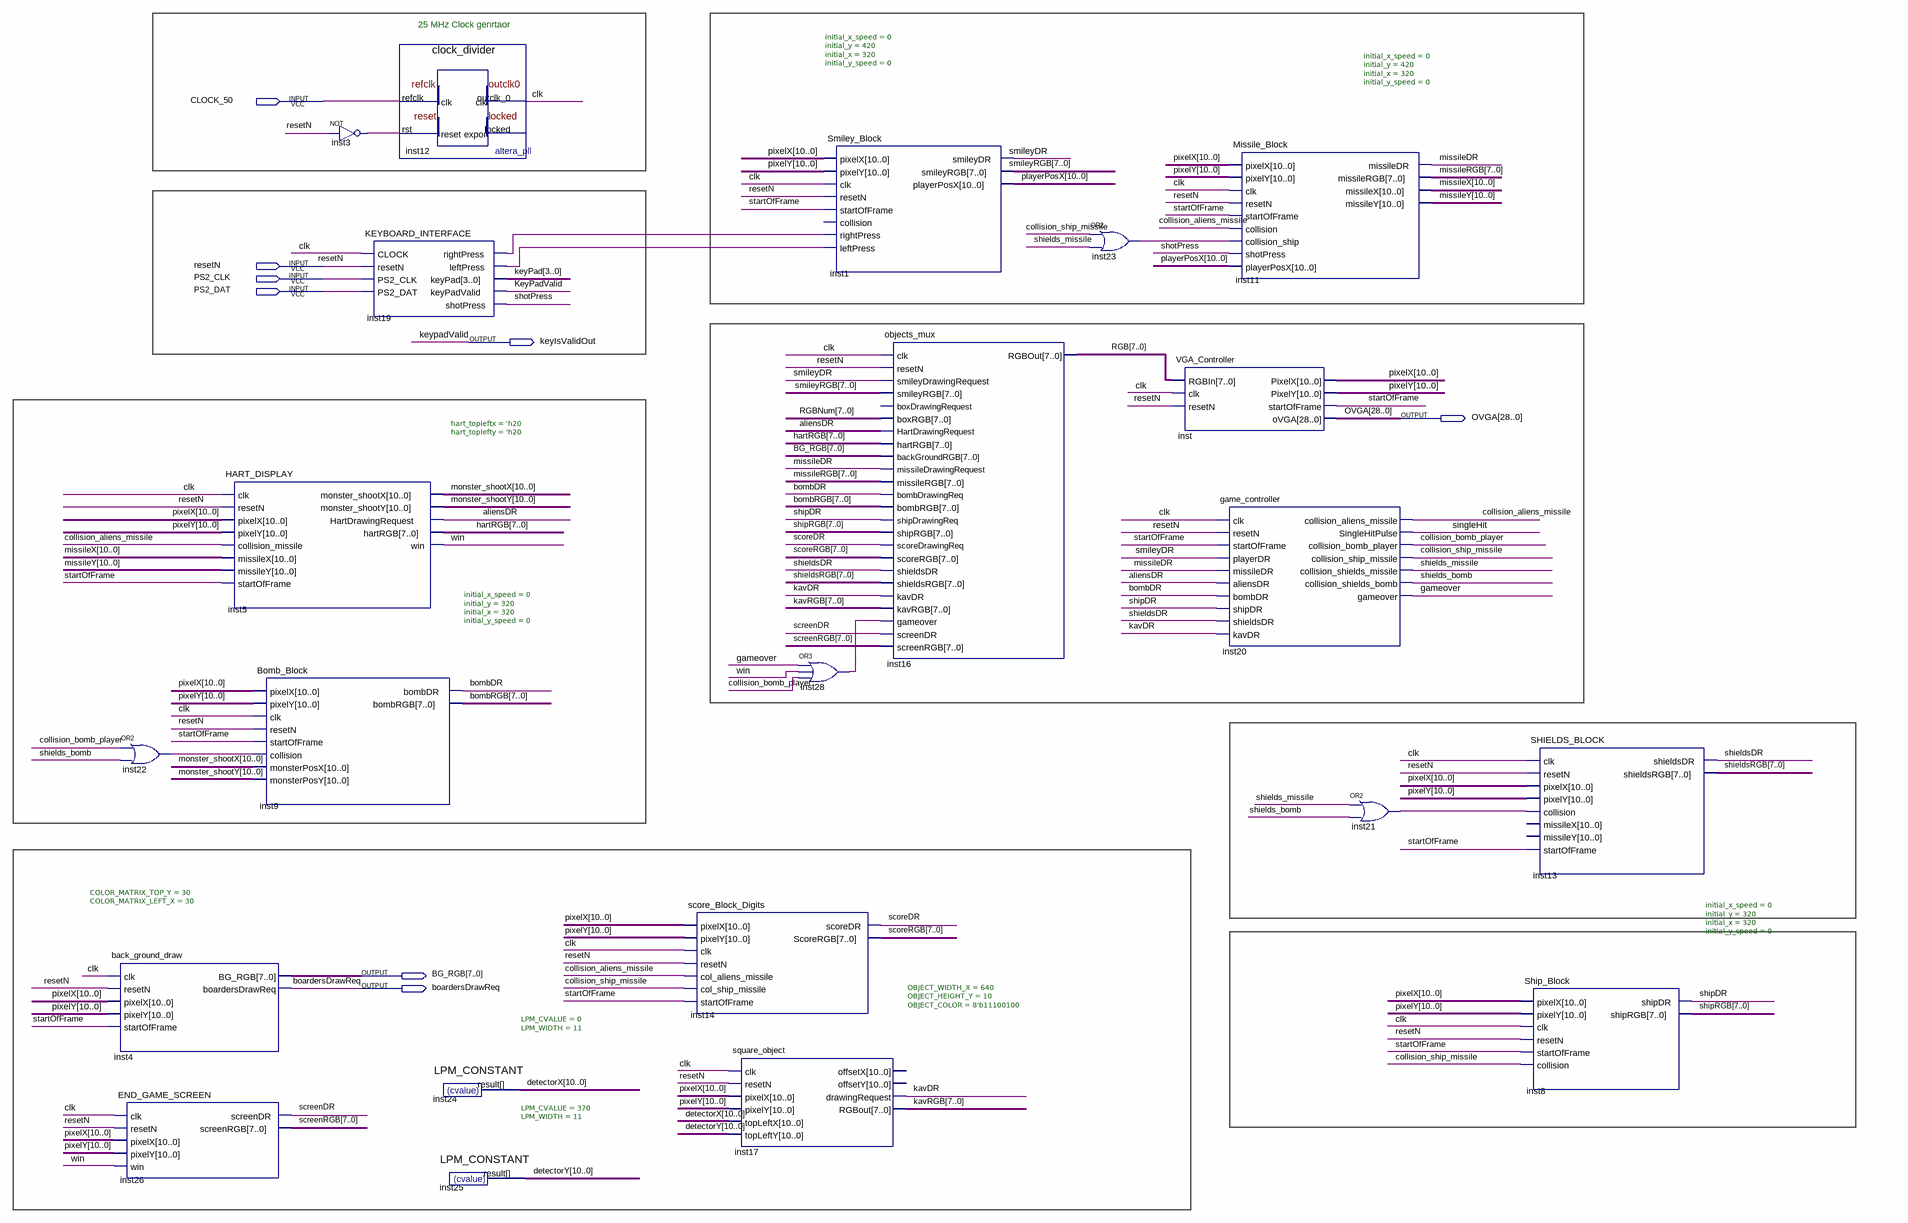
[diagram p0: schematic sheet]
// Quartus schematic TOP_VGA_DEMO_KBD.bdf as structural Verilog: 22 symbols, 8 pins
module TOP_VGA_DEMO_KBD (
  input  CLOCK_50,
  input  resetN,
  input  PS2_CLK,
  input  PS2_DAT,
  output keyIsValidOut,
  output [28:0] OVGA,
  output [7:0] BG_RGB,
  output boardersDrawReq
);

  wire aliensDR, bombDR, clk, collision_aliens_missile, collision_bomb_player, collision_ship_missile,
       gameover, inst3_out, inst19_leftpress, inst19_rightpress, inst21_out, inst22_out, inst23_out,
       inst28_out, kavDR, missileDR, scoreDR, screenDR, shields_bomb, shields_missile, shieldsDR, shipDR,
       shotPress, singleHit, smileyDR, startOfFrame, win;
  wire [3:0] keyPad;
  wire [7:0] bombRGB, hartRGB, kavRGB, missileRGB, RGB, RGBNum, scoreRGB, screenRGB, shieldsRGB, shipRGB,
       smileyRGB;
  wire [10:0] detectorX, detectorY, missileX, missileY, monster_shootX, monster_shootY, pixelX, pixelY,
       playerPosX;

  or inst22 (inst22_out, collision_bomb_player, shields_bomb);
  back_ground_draw #(.COLOR_MATRIX_TOP_Y(30), .COLOR_MATRIX_LEFT_X(30)) inst4 (
    .clk(clk), .resetN(resetN), .pixelX(pixelX), .pixelY(pixelY), .startOfFrame(startOfFrame),
    .BG_RGB(BG_RGB), .boardersDrawReq(boardersDrawReq));
  END_GAME_SCREEN inst26 (
    .clk(clk), .resetN(resetN), .pixelX(pixelX), .pixelY(pixelY), .win(win), .screenDR(screenDR),
    .screenRGB(screenRGB));
  HART_DISPLAY #(.hart_topleftx('h20), .hart_toplefty('h20)) inst5 (
    .clk(clk), .resetN(resetN), .pixelX(pixelX), .pixelY(pixelY),
    .collision_missile(collision_aliens_missile), .missileX(missileX), .missileY(missileY),
    .startOfFrame(startOfFrame), .monster_shootX(monster_shootX), .monster_shootY(monster_shootY),
    .HartDrawingRequest(aliensDR), .hartRGB(hartRGB), .win(win));
  Bomb_Block #(.initial_x_speed(0), .initial_y(320), .initial_x(320), .initial_y_speed(0)) inst9 (
    .pixelX(pixelX), .pixelY(pixelY), .clk(clk), .resetN(resetN), .startOfFrame(startOfFrame),
    .collision(inst22_out), .monsterPosX(monster_shootX), .monsterPosY(monster_shootY), .bombDR(bombDR),
    .bombRGB(bombRGB));
  not inst3 (inst3_out, resetN);
  clock_divider inst12 (.refclk(CLOCK_50), .rst(inst3_out), .outclk_0(clk));  // open: locked
  KEYBOARD_INTERFACE inst19 (
    .CLOCK(clk), .resetN(resetN), .PS2_CLK(PS2_CLK), .PS2_DAT(PS2_DAT), .rightPress(inst19_rightpress),
    .leftPress(inst19_leftpress), .keyPad(keyPad), .keyPadValid(keyIsValidOut), .shotPress(shotPress));
  LPM_CONSTANT #(.LPM_CVALUE(0), .LPM_WIDTH(11)) inst24 (.result(detectorX));
  LPM_CONSTANT #(.LPM_CVALUE(370), .LPM_WIDTH(11)) inst25 (.result(detectorY));
  score_Block_Digits inst14 (
    .pixelX(pixelX), .pixelY(pixelY), .clk(clk), .resetN(resetN),
    .col_aliens_missile(collision_aliens_missile), .col_ship_missile(collision_ship_missile),
    .startOfFrame(startOfFrame), .scoreDR(scoreDR), .ScoreRGB(scoreRGB));
  square_object #(.OBJECT_WIDTH_X(640), .OBJECT_HEIGHT_Y(10), .OBJECT_COLOR(8'b11100100)) inst17 (
    .clk(clk), .resetN(resetN), .pixelX(pixelX), .pixelY(pixelY), .topLeftX(detectorX), .topLeftY(detectorY),
    .drawingRequest(kavDR), .RGBout(kavRGB));  // open: offsetX, offsetY
  or inst28 (inst28_out, gameover, win, collision_bomb_player);
  Smiley_Block #(.initial_x_speed(0), .initial_y(420), .initial_x(320), .initial_y_speed(0)) inst1 (
    .pixelX(pixelX), .pixelY(pixelY), .clk(clk), .resetN(resetN), .startOfFrame(startOfFrame),
    .rightPress(inst19_rightpress), .leftPress(inst19_leftpress), .smileyDR(smileyDR), .smileyRGB(smileyRGB),
    .playerPosX(playerPosX));  // open: collision
  objects_mux inst16 (
    .clk(clk), .resetN(resetN), .smileyDrawingRequest(smileyDR), .smileyRGB(smileyRGB), .boxRGB(RGBNum),
    .HartDrawingRequest(aliensDR), .hartRGB(hartRGB), .backGroundRGB(BG_RGB),
    .missileDrawingRequest(missileDR), .missileRGB(missileRGB), .bombDrawingReq(bombDR), .bombRGB(bombRGB),
    .shipDrawingReq(shipDR), .shipRGB(shipRGB), .scoreDrawingReq(scoreDR), .scoreRGB(scoreRGB),
    .shieldsDR(shieldsDR), .shieldsRGB(shieldsRGB), .kavDR(kavDR), .kavRGB(kavRGB), .gameover(inst28_out),
    .screenDR(screenDR), .screenRGB(screenRGB), .RGBOut(RGB));  // open: boxDrawingRequest
  or inst23 (inst23_out, collision_ship_missile, shields_missile);
  VGA_Controller inst (
    .RGBIn(RGB), .clk(clk), .resetN(resetN), .PixelX(pixelX), .PixelY(pixelY), .startOfFrame(startOfFrame),
    .oVGA(OVGA));
  Missile_Block #(.initial_x_speed(0), .initial_y(420), .initial_x(320), .initial_y_speed(0)) inst11 (
    .pixelX(pixelX), .pixelY(pixelY), .clk(clk), .resetN(resetN), .startOfFrame(startOfFrame),
    .collision(collision_aliens_missile), .collision_ship(inst23_out), .shotPress(shotPress),
    .playerPosX(playerPosX), .missileDR(missileDR), .missileRGB(missileRGB), .missileX(missileX),
    .missileY(missileY));
  game_controller inst20 (
    .clk(clk), .resetN(resetN), .startOfFrame(startOfFrame), .playerDR(smileyDR), .missileDR(missileDR),
    .aliensDR(aliensDR), .bombDR(bombDR), .shipDR(shipDR), .shieldsDR(shieldsDR), .kavDR(kavDR),
    .collision_aliens_missile(collision_aliens_missile), .SingleHitPulse(singleHit),
    .collision_bomb_player(collision_bomb_player), .collision_ship_missile(collision_ship_missile),
    .collision_shields_missile(shields_missile), .collision_shields_bomb(shields_bomb), .gameover(gameover));
  or inst21 (inst21_out, shields_missile, shields_bomb);
  SHIELDS_BLOCK inst13 (
    .clk(clk), .resetN(resetN), .pixelX(pixelX), .pixelY(pixelY), .collision(inst21_out),
    .startOfFrame(startOfFrame), .shieldsDR(shieldsDR), .shieldsRGB(shieldsRGB));  // open: missileX, missileY
  Ship_Block #(.initial_x_speed(0), .initial_y(320), .initial_x(320), .initial_y_speed(0)) inst8 (
    .pixelX(pixelX), .pixelY(pixelY), .clk(clk), .resetN(resetN), .startOfFrame(startOfFrame),
    .collision(collision_ship_missile), .shipDR(shipDR), .shipRGB(shipRGB));

  // Other names for the same wires on the sheet: KeyPadValid = keyIsValidOut

  // Notes on the sheet:
  //   25 MHz Clock genrtaor
endmodule
